# Altium schematic sheet ExpansionBoard.SchDoc: Expansion Board
size A4; Revision: 1; SheetNumber: 1; SheetTotal: 1; SheetSize: A4
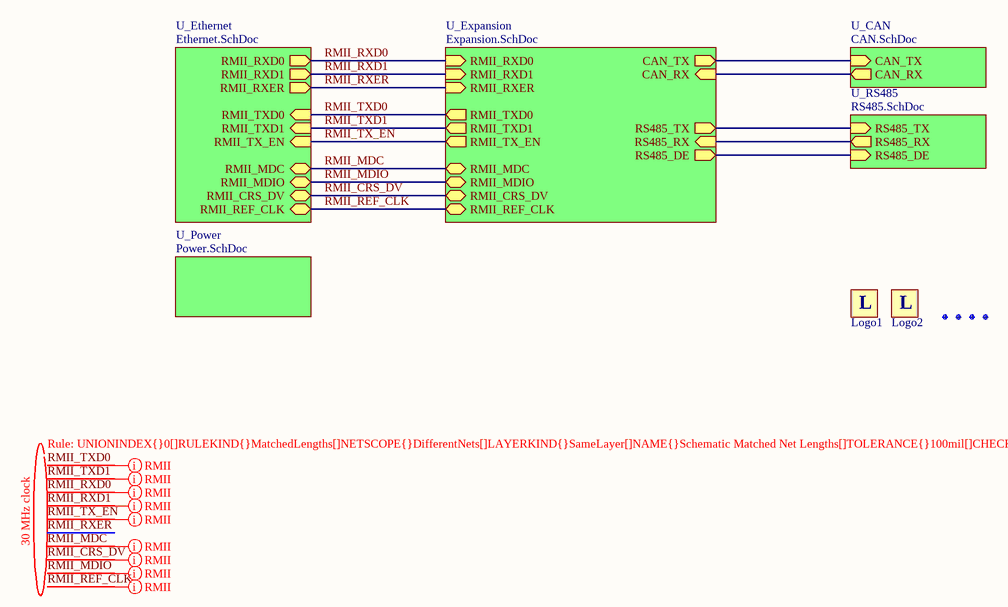
[diagram p0: ExpansionBoard.SchDoc]

## Parts
Fid1  Fiducial mark  [Fiducial]  (value not drawn)  (no BOM)
Fid2  Fiducial mark  [Fiducial]  (value not drawn)  (no BOM)
Fid3  Fiducial mark  [Fiducial]  (value not drawn)  (no BOM)
Fid4  Fiducial mark  [Fiducial]  (value not drawn)  (no BOM)
Logo1  Logo symbol  [LOGO_YILDIZIOT]  (value not drawn)  (no BOM)
Logo2  Logo symbol  [LOGO_YILDIZIOT]  (value not drawn)  (no BOM)

## Sub-sheets
U_CAN = CAN.SchDoc: CAN_TX (in), CAN_RX (out)
U_Ethernet = Ethernet.SchDoc: RMII_TXD0 (in), RMII_TX_EN (in), RMII_RXD0 (out), RMII_REF_CLK (bidir), RMII_CRS_DV (bidir), RMII_MDC (bidir), RMII_MDIO (bidir), RMII_TXD1 (in), RMII_RXD1 (out), RMII_RXER (out)
U_Expansion = Expansion.SchDoc: RMII_TXD0 (out), RMII_TX_EN (out), RMII_TXD1 (out), RMII_RXD1 (in), RMII_RXER (in), RMII_MDC (bidir), RMII_REF_CLK (bidir), RMII_MDIO (bidir), RMII_CRS_DV (bidir), RMII_RXD0 (in), CAN_RX (in), CAN_TX (out), RS485_RX (in), RS485_TX (out), RS485_DE (out)
U_Power = Power.SchDoc: no entries
U_RS485 = RS485.SchDoc: RS485_DE (in), RS485_RX (out), RS485_TX (in)

## Nets
RMII_CRS_DV: sheet U_Ethernet/RMII_CRS_DV, sheet U_Expansion/RMII_CRS_DV
RMII_MDC: sheet U_Ethernet/RMII_MDC, sheet U_Expansion/RMII_MDC
RMII_MDIO: sheet U_Ethernet/RMII_MDIO, sheet U_Expansion/RMII_MDIO
RMII_REF_CLK: sheet U_Ethernet/RMII_REF_CLK, sheet U_Expansion/RMII_REF_CLK
RMII_RXD0: sheet U_Ethernet/RMII_RXD0, sheet U_Expansion/RMII_RXD0
RMII_RXD1: sheet U_Ethernet/RMII_RXD1, sheet U_Expansion/RMII_RXD1
RMII_RXER: sheet U_Ethernet/RMII_RXER, sheet U_Expansion/RMII_RXER
RMII_TX_EN: sheet U_Ethernet/RMII_TX_EN, sheet U_Expansion/RMII_TX_EN
RMII_TXD0: sheet U_Ethernet/RMII_TXD0, sheet U_Expansion/RMII_TXD0
RMII_TXD1: sheet U_Ethernet/RMII_TXD1, sheet U_Expansion/RMII_TXD1
(unnamed): sheet U_CAN/CAN_TX, sheet U_Expansion/CAN_TX
(unnamed): sheet U_CAN/CAN_RX, sheet U_Expansion/CAN_RX
(unnamed): sheet U_RS485/RS485_DE, sheet U_Expansion/RS485_DE
(unnamed): sheet U_RS485/RS485_RX, sheet U_Expansion/RS485_RX
(unnamed): sheet U_RS485/RS485_TX, sheet U_Expansion/RS485_TX

## Layout directives
rule Matched Net Lengths [Tolerance = 100mil]; net class ETHERNET: RMII_CRS_DV, RMII_MDC, RMII_MDIO, RMII_REF_CLK, RMII_RXD0, RMII_RXD1, RMII_TX_EN, RMII_TXD0, RMII_TXD1

## Notes on the sheet
- 30 MHz clock
- Title:
- Size:
- Project:
- Revision:
- Sheet
- of
- Date:
- YıLDıZ IoT
- Elperek Mahallesi
- Saray Sokak, No:12
- SAKARYA / TURKEY
- File:
- (in symbol Logo) L

## Library data of the parts
Fid1-Fid4 = Fiducial: Part Number: Fid-Mark; Artikkelnr Noca: N.A.; Manufacturer: *; Manufacturer Part Number: *; Datasheet: *; LatestRevisionDate: 2009-12-12; Pin Count: 1; Publisher: Nordic Semiconductor; Published: 2009-12-12; Value: *; Note: *; Supplier: *; Supplier part number: *; 2nd source Supplier: *; 2nd source part number: *; Footprint Doc: Fiducial; Artikkelnr Simpro: N.A.
Logo1 Logo2 = Logo: Schematic symbol for Logo